# EAGLE schematic NAMUR (EAGLE 9.6.2)
Assembly variants: basic

## Sheet 1 of 3: Input connector, power
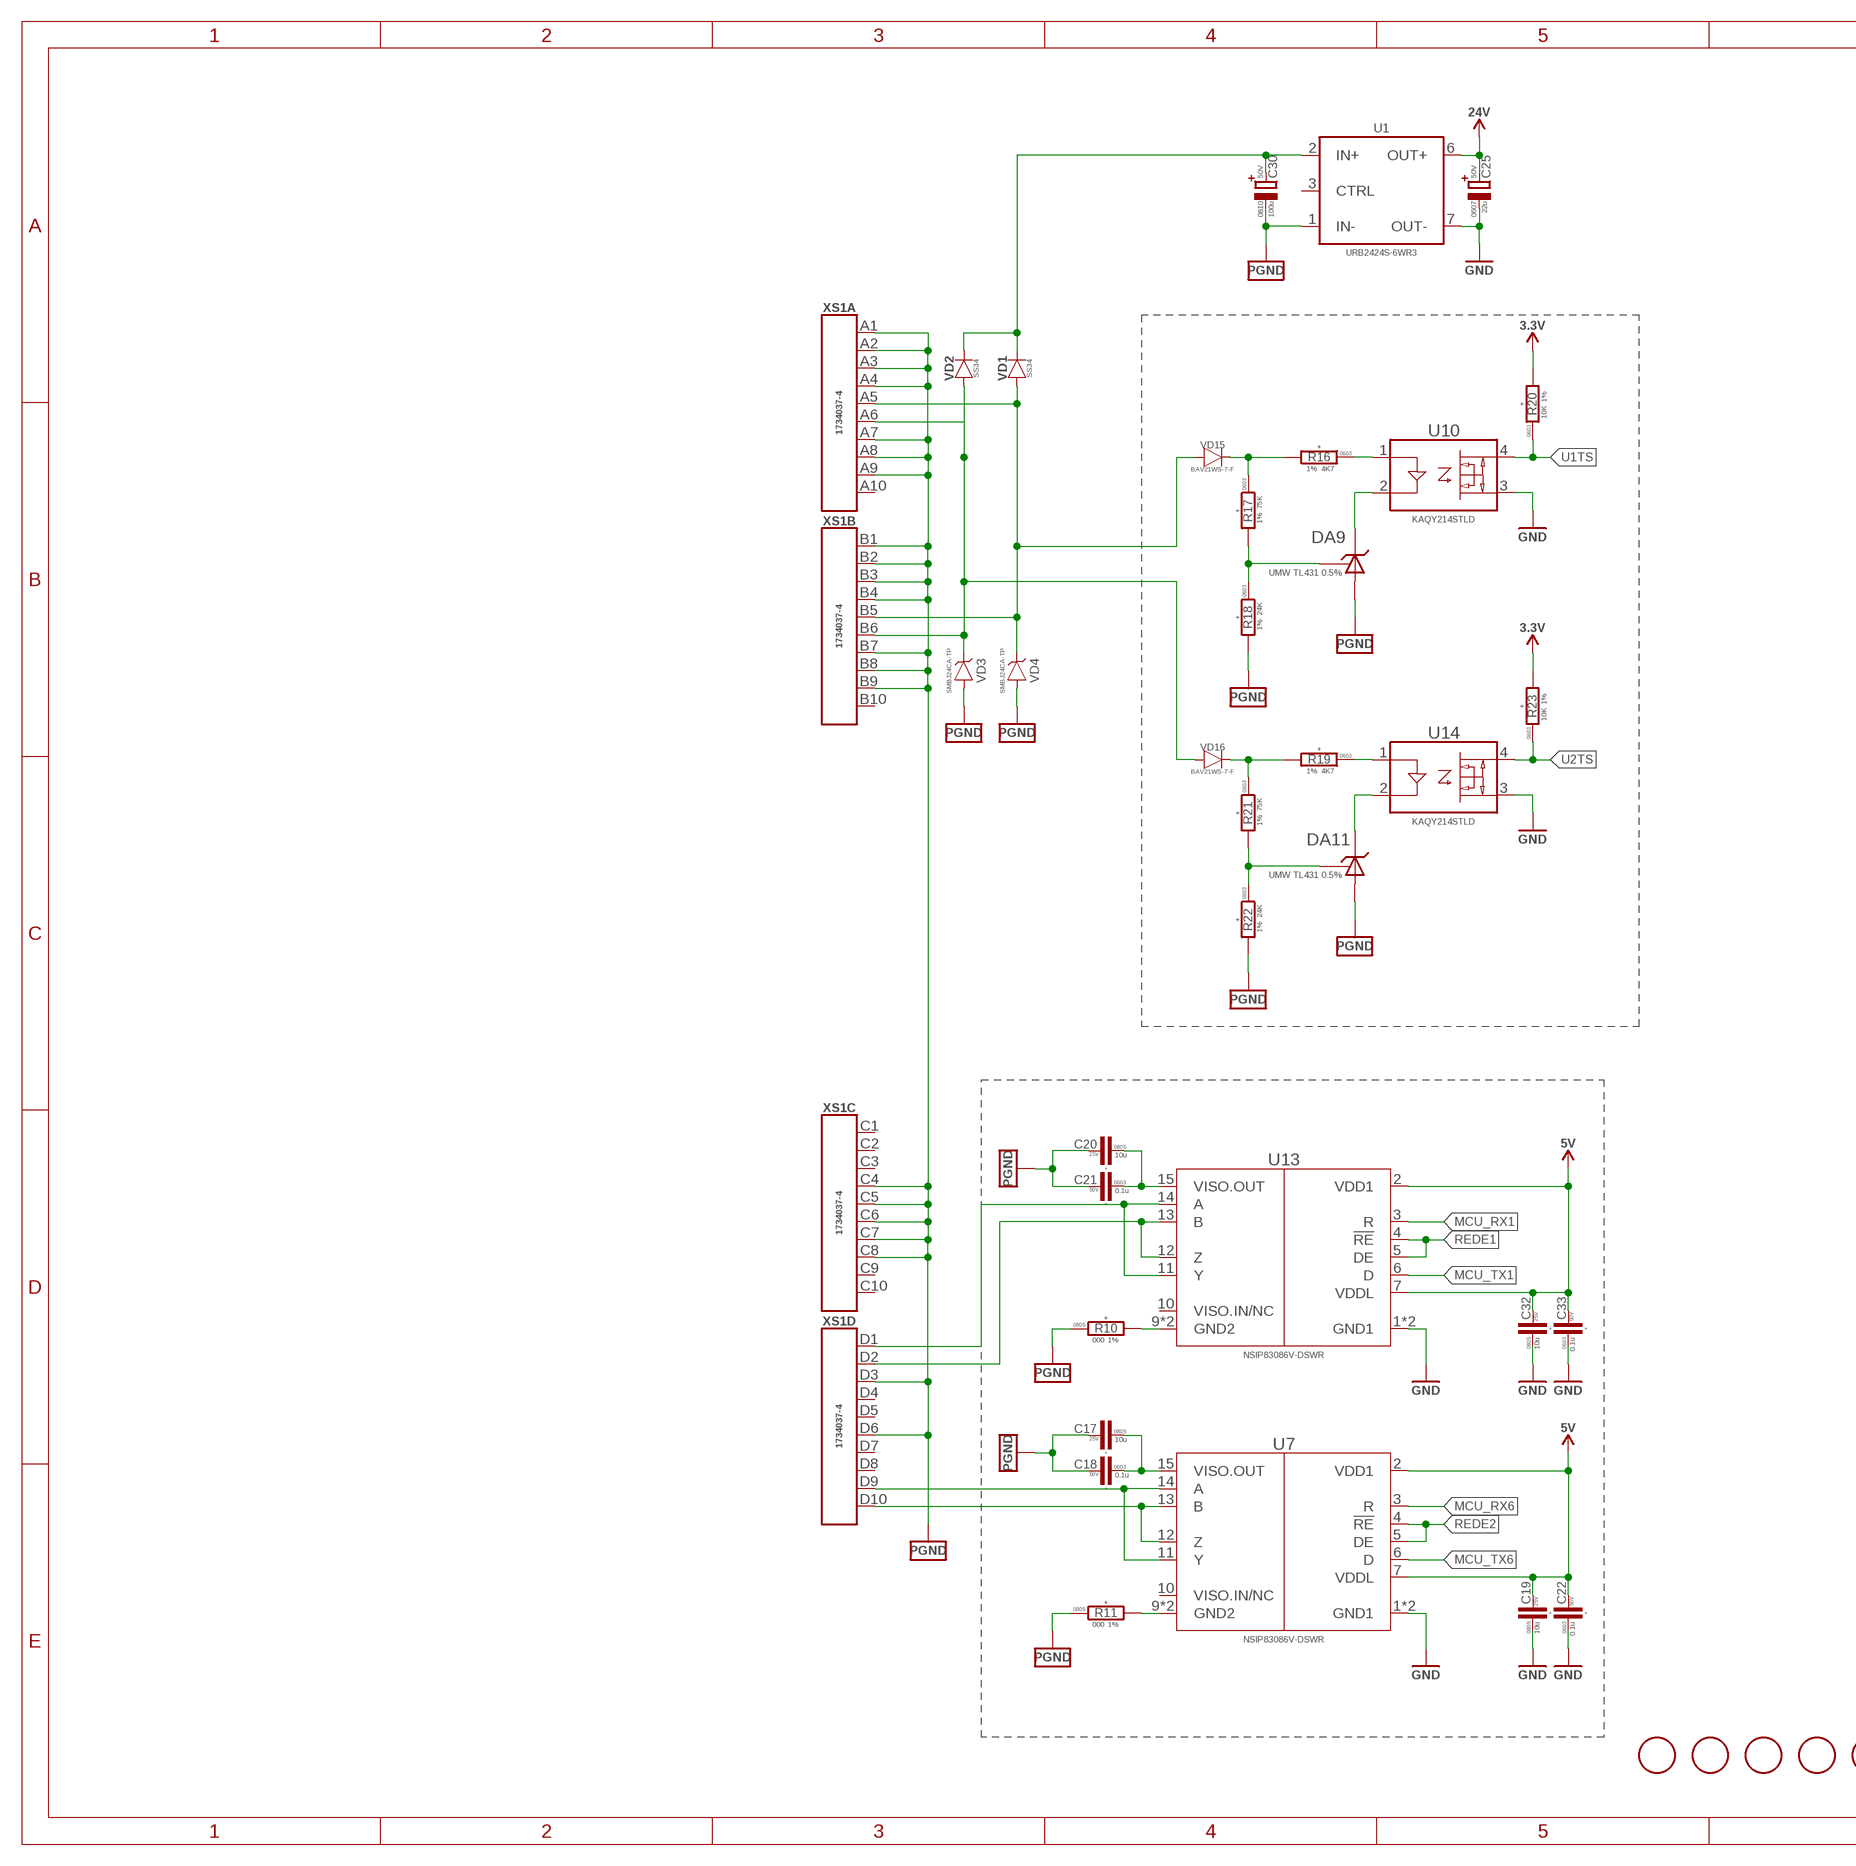
[diagram p0: schematic, sheet 1, part 1 of 2]
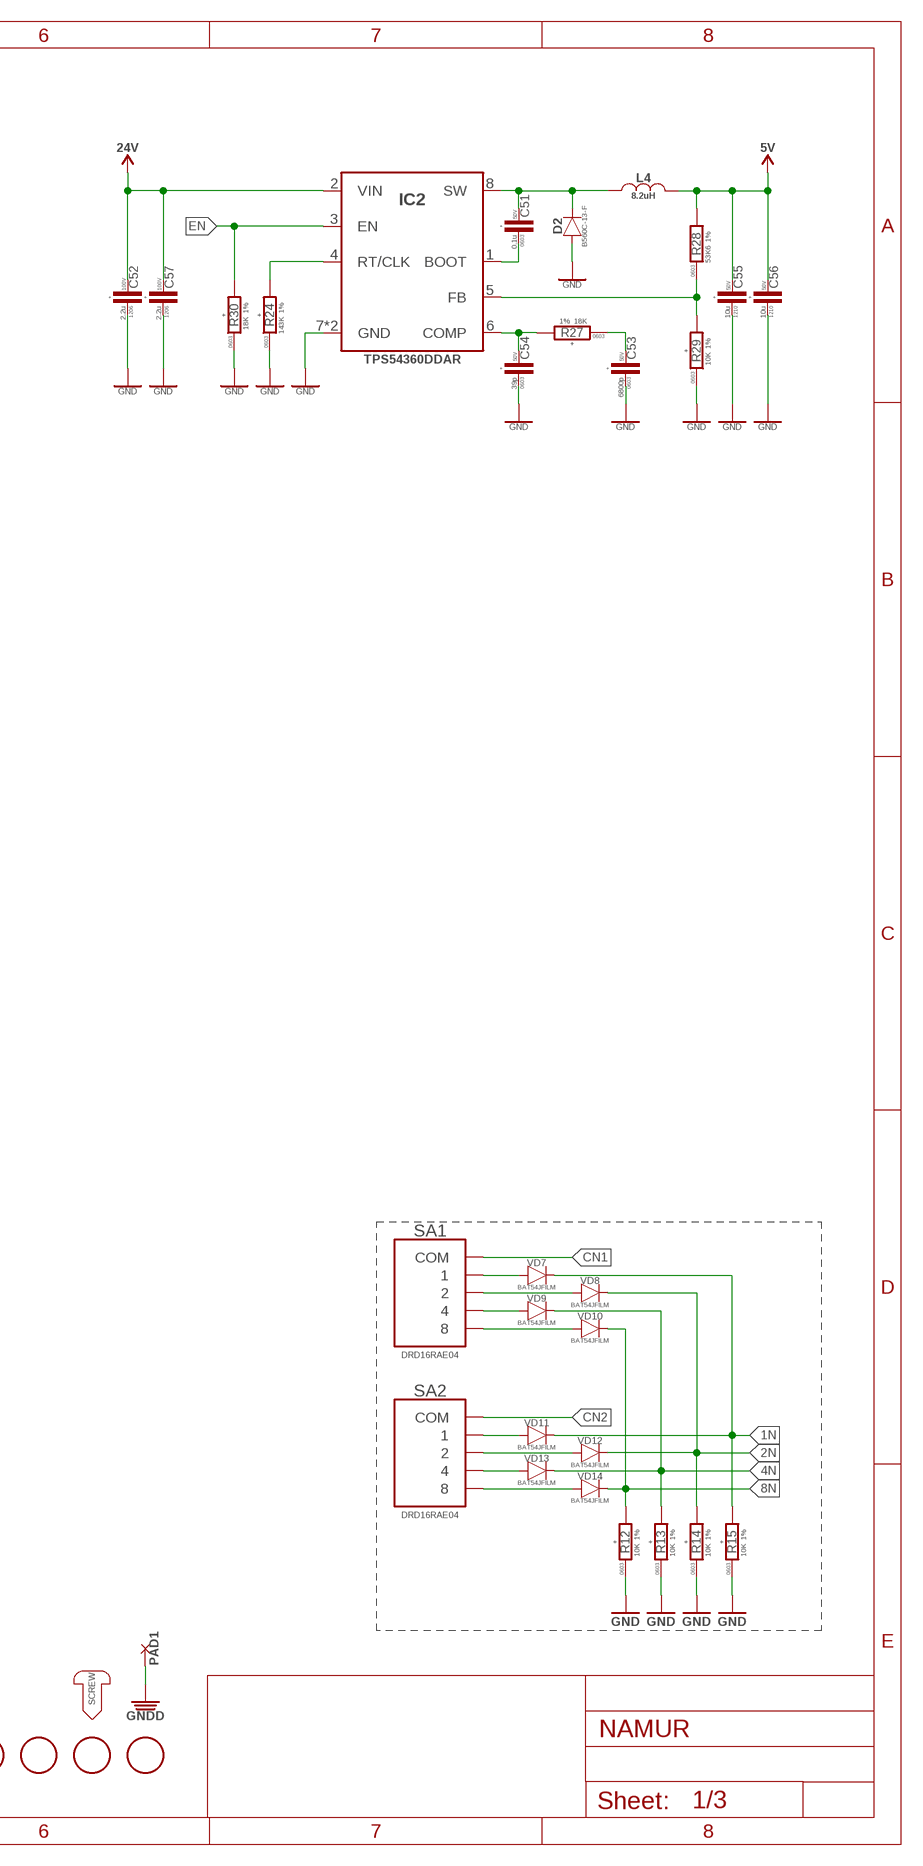
[diagram p1: schematic, sheet 1, part 2 of 2]

### Parts
C17  10u  C-0805  [C0805]
C18  0.1u  C-0603  [C0603]
C19  10u  C-0805  [C0805]
C20  10u  C-0805  [C0805]
C21  0.1u  C-0603  [C0603]
C22  0.1u  C-0603  [C0603]
C25  22u  CPOL-SMD_6.3X7.7  [CAP_SMD_6.3X7.7]
C30  100u  CPOL-SMD-8X10  [SMD-0810]
C32  10u  C-0805  [C0805]
C33  0.1u  C-0603  [C0603]
C51  0.1u  C-0603  [C0603]
C52  2.2u  C-1206  [C1206]
C53  6800p  C-0603  [C0603]
C54  39p  C-0603  [C0603]
C55  10u  C-1210  [C1210]
C56  10u  C-1210  [C1210]
C57  2.2u  C-1206  [C1206]
D2  B560C  [DO-214AB(SMC)]
DA9  TL431  [SOT23-3]
DA11  TL431  [SOT23-3]
FD1  FIDUCIALMOUNT  [FIDUCIAL_MOUNT]  (not fitted in variant basic)
FD2  FIDUCIALMOUNT  [FIDUCIAL_MOUNT]  (not fitted in variant basic)
FD3  FIDUCIALMOUNT  [FIDUCIAL_MOUNT]  (not fitted in variant basic)
FD4  FIDUCIALMOUNT  [FIDUCIAL_MOUNT]  (not fitted in variant basic)
FD5  FIDUCIALMOUNT  [FIDUCIAL_MOUNT]  (not fitted in variant basic)
FD6  FIDUCIALMOUNT  [FIDUCIAL_MOUNT]  (not fitted in variant basic)
FD7  FIDUCIALMOUNT  [FIDUCIAL_MOUNT]  (not fitted in variant basic)
IC2  TPS54360  [SOIC8-POWERPAD]
L4  8.2uH  8.2µH-CDRH105R  [CDRH105R]
PAD1  PAD-8.3X3  [8.3X3]  (not fitted in variant basic)
R10  000  R-1%-0805  [R0805]
R11  000  R-1%-0805  [R0805]
R12  10K  R-1%-0603  [R0603]
R13  10K  R-1%-0603  [R0603]
R14  10K  R-1%-0603  [R0603]
R15  10K  R-1%-0603  [R0603]
R16  4K7  R-1%-0603  [R0603]
R17  75K  R-1%-0603  [R0603]
R18  24K  R-1%-0603  [R0603]
R19  4K7  R-1%-0603  [R0603]
R20  10K  R-1%-0603  [R0603]
R21  75K  R-1%-0603  [R0603]
R22  24K  R-1%-0603  [R0603]
R23  10K  R-1%-0603  [R0603]
R24  143K  R-1%-0603  [R0603]
R27  18K  R-1%-0603  [R0603]
R28  53K6  R-1%-0603  [R0603]
R29  10K  R-1%-0603  [R0603]
R30  18K  R-1%-0603  [R0603]
SA1  DRD16RAE04  [DRD16RAE04]
SA2  DRD16RAE04  [DRD16RAE04]
SCR1  SCREW-M3-D3.1  [PCB_SCREW_M3-D3.1]  (not fitted in variant basic)
U1  URB2424S-6WR3  [URB_S-6WR3]
U7  NSIP83086(V)  [SOIC16-300MIL]
U10  KAQY214-SOP-4  [SOP-4]
U13  NSIP83086(V)  [SOIC16-300MIL]
U14  KAQY214-SOP-4  [SOP-4]
VD1  SS34  [DO-214AC(SMA)]
VD2  SS34  [DO-214AC(SMA)]
VD3  SMBJ24CA-SMB  [DO-214AA(SMB)]
VD4  SMBJ24CA-SMB  [DO-214AA(SMB)]
VD7  BAT54JFILM  [SOD323]
VD8  BAT54JFILM  [SOD323]
VD9  BAT54JFILM  [SOD323]
VD10  BAT54JFILM  [SOD323]
VD11  BAT54JFILM  [SOD323]
VD12  BAT54JFILM  [SOD323]
VD13  BAT54JFILM  [SOD323]
VD14  BAT54JFILM  [SOD323]
VD15  BAV21WS  [SOD323]
VD16  BAV21WS  [SOD323]
XS1  1734037-4  [1734037-4]

### Nets
1N: R15.2 VD7.C VD11.C ; also sheet 2
2N: R14.2 VD8.C VD12.C ; also sheet 2
4N: R13.2 VD9.C VD13.C ; also sheet 2
8N: R12.2 VD10.C VD14.C ; also sheet 2
BOOT5: C51.1 IC2.1(BOOT)
CN1: SA1.C_1(COM) SA1.C_2(COM) ; also sheet 2
CN2: SA2.C_1(COM) SA2.C_2(COM) ; also sheet 2
EN: IC2.3(EN) R30.2 ; also sheet 3
GND: C19.1 C22.1 C25.- C32.1 C33.1 C52.P$1 C53.1 C54.1 C55.1 C56.1 C57.P$1 D2.A IC2.7(GND) IC2.POWERPAD(GND) R12.1 R13.1 R14.1 R15.1 R24.1 R29.1 R30.1 U1.7(OUT-) U7.1(GND1) U7.8(GND1) U10.3(EMITTER) U13.1(GND1) U13.8(GND1) U14.3(EMITTER) ; also sheet 2,3
GNDD: PAD1.P$1 ; also sheet 3
ISO24V: C30.+ U1.2(IN+) VD1.C VD2.C
MCU_RX1: U13.3(R) ; also sheet 2
MCU_RX6: U7.3(R) ; also sheet 2
MCU_TX1: U13.6(D) ; also sheet 2
MCU_TX6: U7.6(D) ; also sheet 2
N$17: DA9.2(C) U10.2(C)
N$18: DA9.1(R) R17.2 R18.1
N$19: R16.1 U10.1(A)
N$20: R16.2 R17.1 VD15.C
N$22: DA11.2(C) U14.2(C)
N$23: DA11.1(R) R21.2 R22.1
N$24: R19.1 U14.1(A)
N$25: R19.2 R21.1 VD16.C
N$33: IC2.4(RT/CLK) R24.2
N$34: C54.2 IC2.6(COMP) R27.2
N$35: C53.2 R27.1
N$36: IC2.5(FB) R28.1 R29.2
N$43: R11.2 U7.9(GND2) U7.16(GND2)
N$46: C20.1 C21.1 U13.15(VISO.OUT)
N$48: VD1.A VD4.C VD15.A XS1.A5 XS1.B5
N$49: VD2.A VD3.C VD16.A XS1.A6 XS1.B6
N$51: U7.11(Y) U7.14(A) XS1.D9
N$53: U7.12(Z) U7.13(B) XS1.D10
N$69: R10.2 U13.9(GND2) U13.16(GND2)
N$74: U13.11(Y) U13.14(A) XS1.D1
N$75: U13.12(Z) U13.13(B) XS1.D2
N$82: C17.1 C18.1 U7.15(VISO.OUT)
N$84: SA1.1 VD7.A
N$85: SA1.2 VD8.A
N$86: SA1.4 VD9.A
N$90: SA1.8 VD10.A
N$92: SA2.1 VD11.A
N$93: SA2.2 VD12.A
N$94: SA2.4 VD13.A
N$98: SA2.8 VD14.A
PGND: C17.2 C18.2 C20.2 C21.2 C30.- DA9.3(A) DA11.3(A) R10.1 R11.1 R18.2 R22.2 U1.1(IN-) VD3.A VD4.A XS1.A1 XS1.A2 XS1.A3 XS1.A4 XS1.A7 XS1.A8 XS1.A9 XS1.B1 XS1.B2 XS1.B3 XS1.B4 XS1.B7 XS1.B8 XS1.B9 XS1.C4 XS1.C5 XS1.C6 XS1.C7 XS1.C8 XS1.D3 XS1.D6
REDE1: U13.4(!RE) U13.5(DE) ; also sheet 2
REDE2: U7.4(!RE) U7.5(DE) ; also sheet 2
SW10: C51.2 D2.C IC2.8(SW) L4.1
U1TS: R20.1 U10.4(COLLECTOR) ; also sheet 2
U2TS: R23.1 U14.4(COLLECTOR) ; also sheet 2
VDD_3V3: R20.2 R23.2 ; supply symbol labelled 3.3V ; also sheet 2
VDD_5V: C19.2 C22.2 C32.2 C33.2 C55.2 C56.2 L4.2 R28.2 U7.2(VDD1) U7.7(VDDL) U13.2(VDD1) U13.7(VDDL) ; supply symbol labelled 5V ; also sheet 2,3
VDD_24V [HV]: C25.+ C52.P$2 C57.P$2 IC2.2(VIN) U1.6(OUT+) ; supply symbol labelled 24V ; also sheet 3
Unconnected: U1.3(CTRL) U7.10(VISO.IN/NC) U13.10(VISO.IN/NC) XS1.A10 XS1.B10 XS1.C1 XS1.C2 XS1.C3 XS1.C9 XS1.C10 XS1.D4 XS1.D5 XS1.D7 XS1.D8

## Sheet 2 of 3: MCU
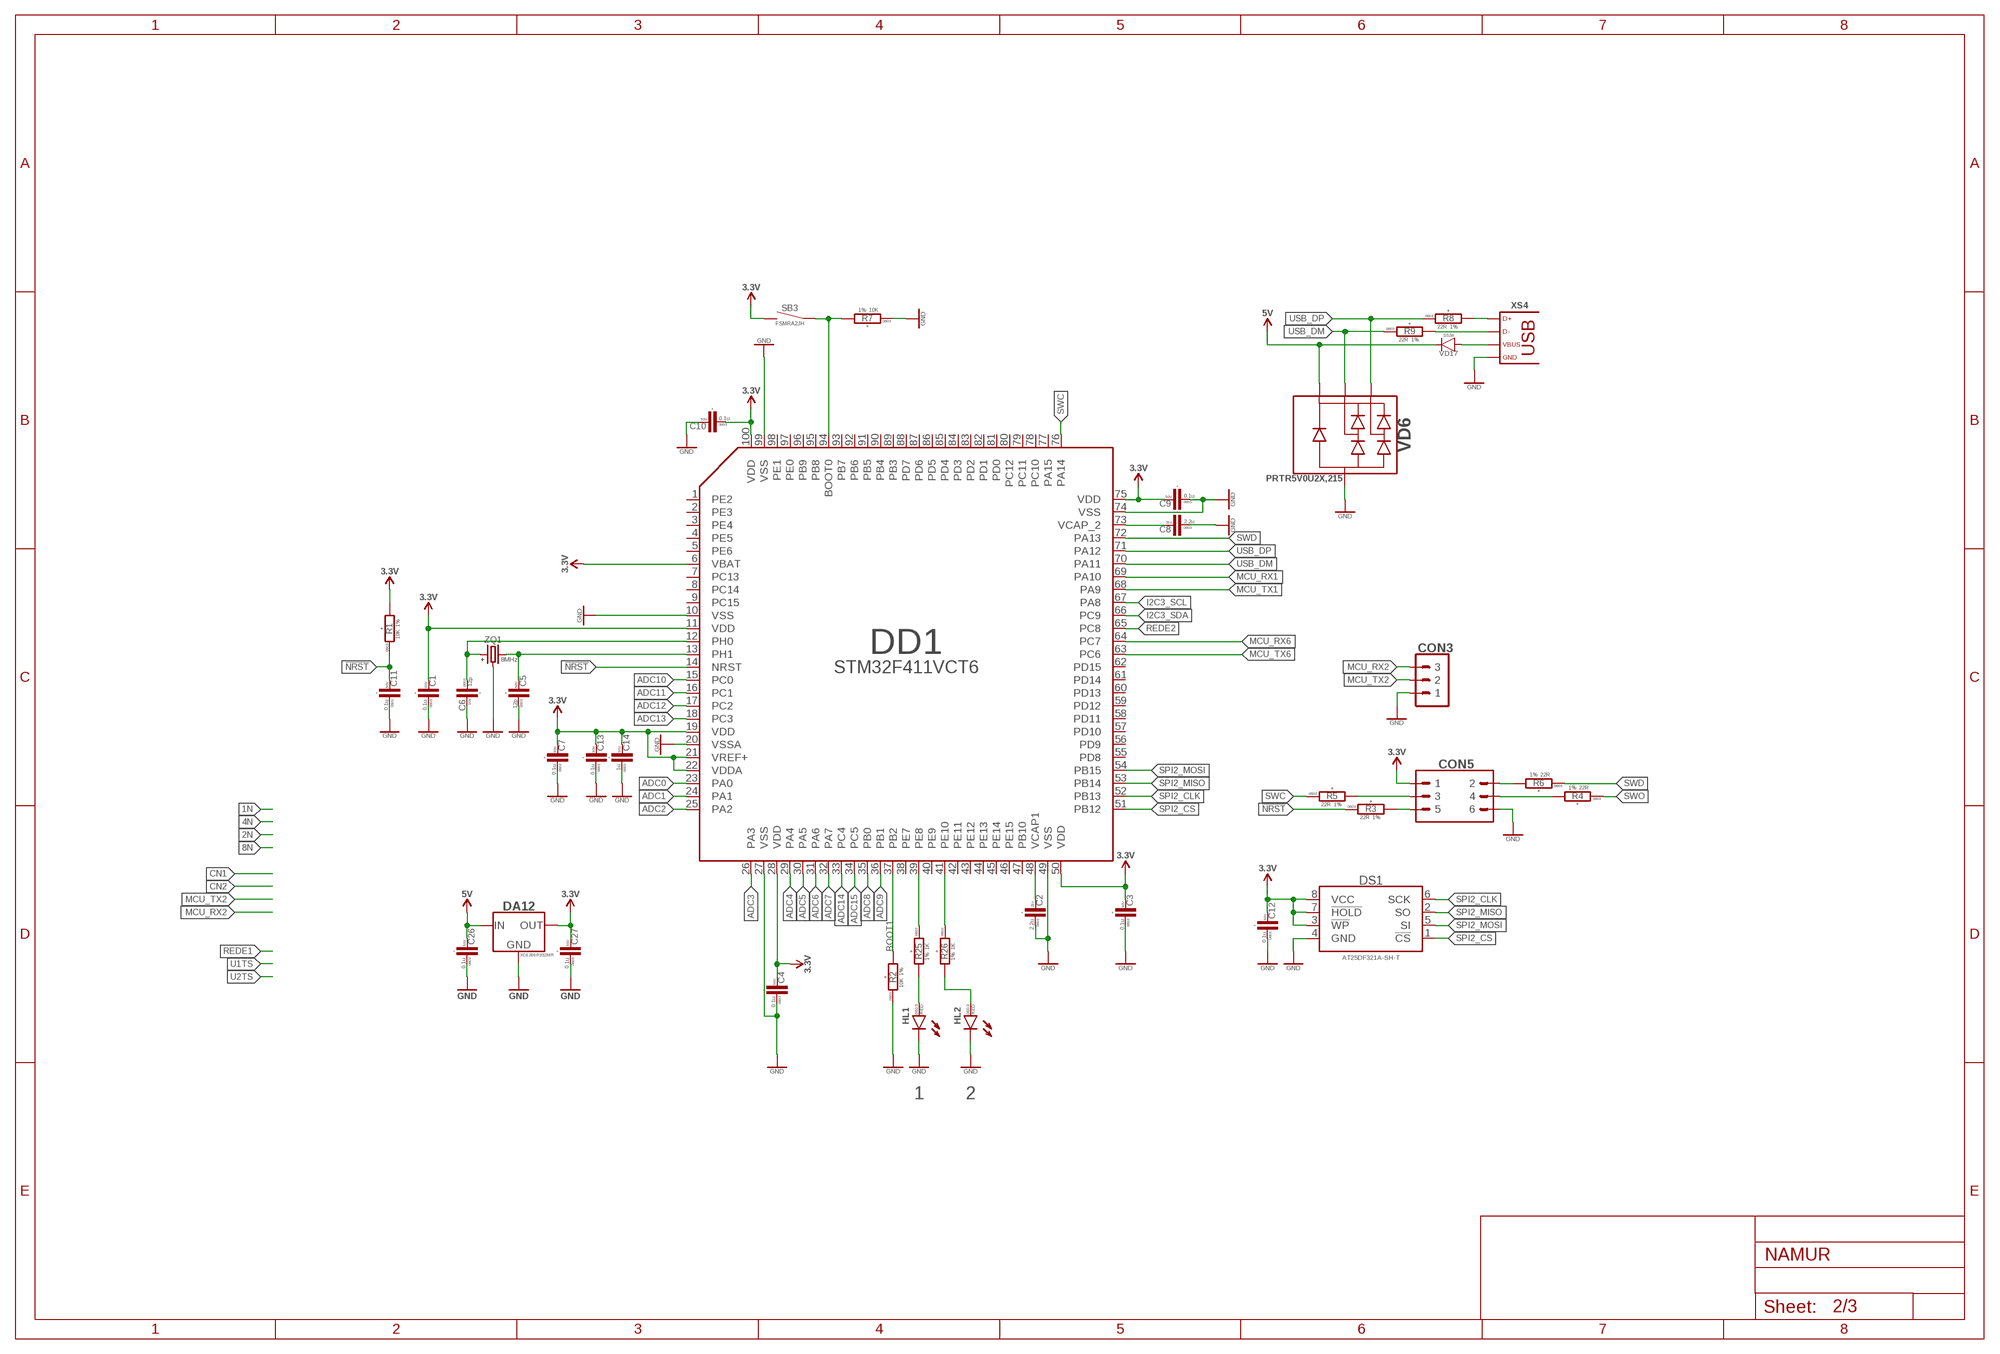
[diagram p2: schematic, sheet 2]

### Parts
C1  0.1u  C-0603  [C0603]
C2  2.2u  C-0603  [C0603]
C3  0.1u  C-0603  [C0603]
C4  0.1u  C-0603  [C0603]
C5  12p  C-0603  [C0603]
C6  12p  C-0603  [C0603]
C7  0.1u  C-0603  [C0603]
C8  2.2u  C-0603  [C0603]
C9  0.1u  C-0603  [C0603]
C10  0.1u  C-0603  [C0603]
C11  0.1u  C-0603  [C0603]
C12  0.1u  C-0603  [C0603]
C13  0.1u  C-0603  [C0603]
C14  1u  C-0603  [C0603]
C26  0.1u  C-0603  [C0603]
C27  0.1u  C-0603  [C0603]
CON3  PINHEAD_1X03-2.54  [PLS3]  (not fitted in variant basic)
CON5  PINHEAD_2X03-PTH-2.54  [PLD6]  (not fitted in variant basic)
DA12  XC6206P332  [SOT23-3]
DD1  STM32F411VCT6  [LQFP100]
DS1  AT25DF321A  [SOIC8-208MIL]
HL1  LED-0603  [LED0603]
HL2  LED-0603  [LED0603]
R1  10K  R-1%-0603  [R0603]
R2  10K  R-1%-0603  [R0603]
R3  22R  R-1%-0603  [R0603]
R4  22R  R-1%-0603  [R0603]
R5  22R  R-1%-0603  [R0603]
R6  22R  R-1%-0603  [R0603]
R7  10K  R-1%-0603  [R0603]
R8  22R  R-1%-0603  [R0603]
R9  22R  R-1%-0603  [R0603]
R25  1K  R-1%-0603  [R0603]
R26  1K  R-1%-0603  [R0603]
SB3  TACT_SWITCH-KLS-KLS7-TS6606  [KLS7-TS6606-5.0-180]
VD6  PRTR5V0U2X  [SOT143B]
VD17  SS34  [DO-214AC(SMA)]
XS4  USB-TYPE-B  [USB-B]
ZQ1  8MHz  CRYSTAL-4P-3.2X2.5  [OSCILLATOR-3.2X2.5-4P]

### Nets
!NRST: C11.2 DD1.14(NRST) R1.1 R3.1
ADC0: DD1.23(PA0) ; also sheet 3
ADC1: DD1.24(PA1) ; also sheet 3
ADC2: DD1.25(PA2) ; also sheet 3
ADC3: DD1.26(PA3) ; also sheet 3
ADC4: DD1.29(PA4) ; also sheet 3
ADC5: DD1.30(PA5) ; also sheet 3
ADC6: DD1.31(PA6) ; also sheet 3
ADC7: DD1.32(PA7) ; also sheet 3
ADC8: DD1.35(PB0) ; also sheet 3
ADC9: DD1.36(PB1) ; also sheet 3
ADC10: DD1.15(PC0) ; also sheet 3
ADC11: DD1.16(PC1) ; also sheet 3
ADC12: DD1.17(PC2) ; also sheet 3
ADC13: DD1.18(PC3) ; also sheet 3
ADC14: DD1.33(PC4) ; also sheet 3
ADC15: DD1.34(PC5) ; also sheet 3
BOOT0: DD1.94(BOOT0) R7.2 SB3.1
BOOT1: DD1.37(PB2) R2.2
GND: C1.1 C2.1 C3.1 C4.1 C5.1 C6.2 C7.1 C8.1 C9.1 C10.2 C11.1 C12.1 C13.1 C14.1 C26.1 C27.1 CON3.1 CON5.6 DA12.1(GND) DD1.10(VSS) DD1.20(VSSA) DD1.27(VSS) DD1.49(VSS) DD1.74(VSS) DD1.99(VSS) DS1.4(GND) HL1.C HL2.C R2.1 R7.1 VD6.1(C) XS4.4(GND) XS4.5_1(GND) XS4.5_2(GND) ZQ1.2(GND) ZQ1.4(GND) ; also sheet 1,3
I2C3_SCL: DD1.67(PA8) ; also sheet 3
I2C3_SDA: DD1.66(PC9) ; also sheet 3
MCU_RX1: DD1.69(PA10) ; also sheet 1
MCU_RX2: CON3.3
MCU_RX6: DD1.64(PC7) ; also sheet 1
MCU_TX1: DD1.68(PA9) ; also sheet 1
MCU_TX2: CON3.2
MCU_TX6: DD1.63(PC6) ; also sheet 1
N$1: C2.2 DD1.48(VCAP1)
N$2: C8.2 DD1.73(VCAP_2)
N$3: CON5.5 R3.2
N$4: C6.1 DD1.12(PH0) ZQ1.1
N$5: C5.2 DD1.13(PH1) ZQ1.3
N$6: CON5.4 R4.2
N$7: CON5.3 R5.2
N$8: CON5.2 R6.2
N$21: HL1.A R25.2
N$26: HL2.A R26.2
N$27: R25.1
N$37: R26.1
N$70: R9.2 XS4.2(D-)
N$71: R8.2 XS4.3(D+)
N$72: VD17.A XS4.1(VBUS)
REDE2: DD1.65(PC8) ; also sheet 1
SPI2_CLK: DD1.52(PB13) DS1.6(SCK)
SPI2_CS: DD1.51(PB12) DS1.1(!CS)
SPI2_MISO: DD1.53(PB14) DS1.2(SO)
SPI2_MOSI: DD1.54(PB15) DS1.5(SI)
SWC: DD1.76(PA14) R5.1
SWD: DD1.72(PA13) R6.1
SWO: R4.1
USB_DM: DD1.70(PA11) R9.1 VD6.3(D2)
USB_DP: DD1.71(PA12) R8.1 VD6.2(D1)
VDD_3V3: C1.2 C3.2 C4.2 C7.2 C9.2 C10.1 C12.2 C13.2 C14.2 C27.2 CON5.1 DA12.2(OUT) DD1.6(VBAT) DD1.11(VDD) DD1.21(VREF+) DD1.22(VDDA) DD1.28(VDD) DD1.50(VDD) DD1.75(VDD) DD1.100(VDD) DS1.3(!WP) DS1.7(!HOLD) DS1.8(VCC) R1.2 SB3.2 ; supply symbol labelled 3.3V ; also sheet 1
VDD_5V: C26.2 DA12.3(IN) VD6.4(A) VD17.C ; supply symbol labelled 5V ; also sheet 1,3
Unconnected: DD1.1(PE2) DD1.2(PE3) DD1.3(PE4) DD1.4(PE5) DD1.5(PE6) DD1.7(PC13) DD1.8(PC14) DD1.9(PC15) DD1.19(VDD) DD1.38(PE7) DD1.39(PE8) DD1.40(PE9) DD1.41(PE10) DD1.42(PE11) DD1.43(PE12) DD1.44(PE13) DD1.45(PE14) DD1.46(PE15) DD1.47(PB10) DD1.55(PD8) DD1.56(PD9) DD1.57(PD10) DD1.58(PD11) DD1.59(PD12) DD1.60(PD13) DD1.61(PD14) DD1.62(PD15) DD1.77(PA15) DD1.78(PC10) DD1.79(PC11) DD1.80(PC12) DD1.81(PD0) DD1.82(PD1) DD1.83(PD2) DD1.84(PD3) DD1.85(PD4) DD1.86(PD5) DD1.87(PD6) DD1.88(PD7) DD1.89(PB3) DD1.90(PB4) DD1.91(PB5) DD1.92(PB6) DD1.93(PB7) DD1.95(PB8) DD1.96(PB9) DD1.97(PE0) DD1.98(PE1)

### Notes on the sheet
- 1 | 2

## Sheet 3 of 3: Measuring part and main connector
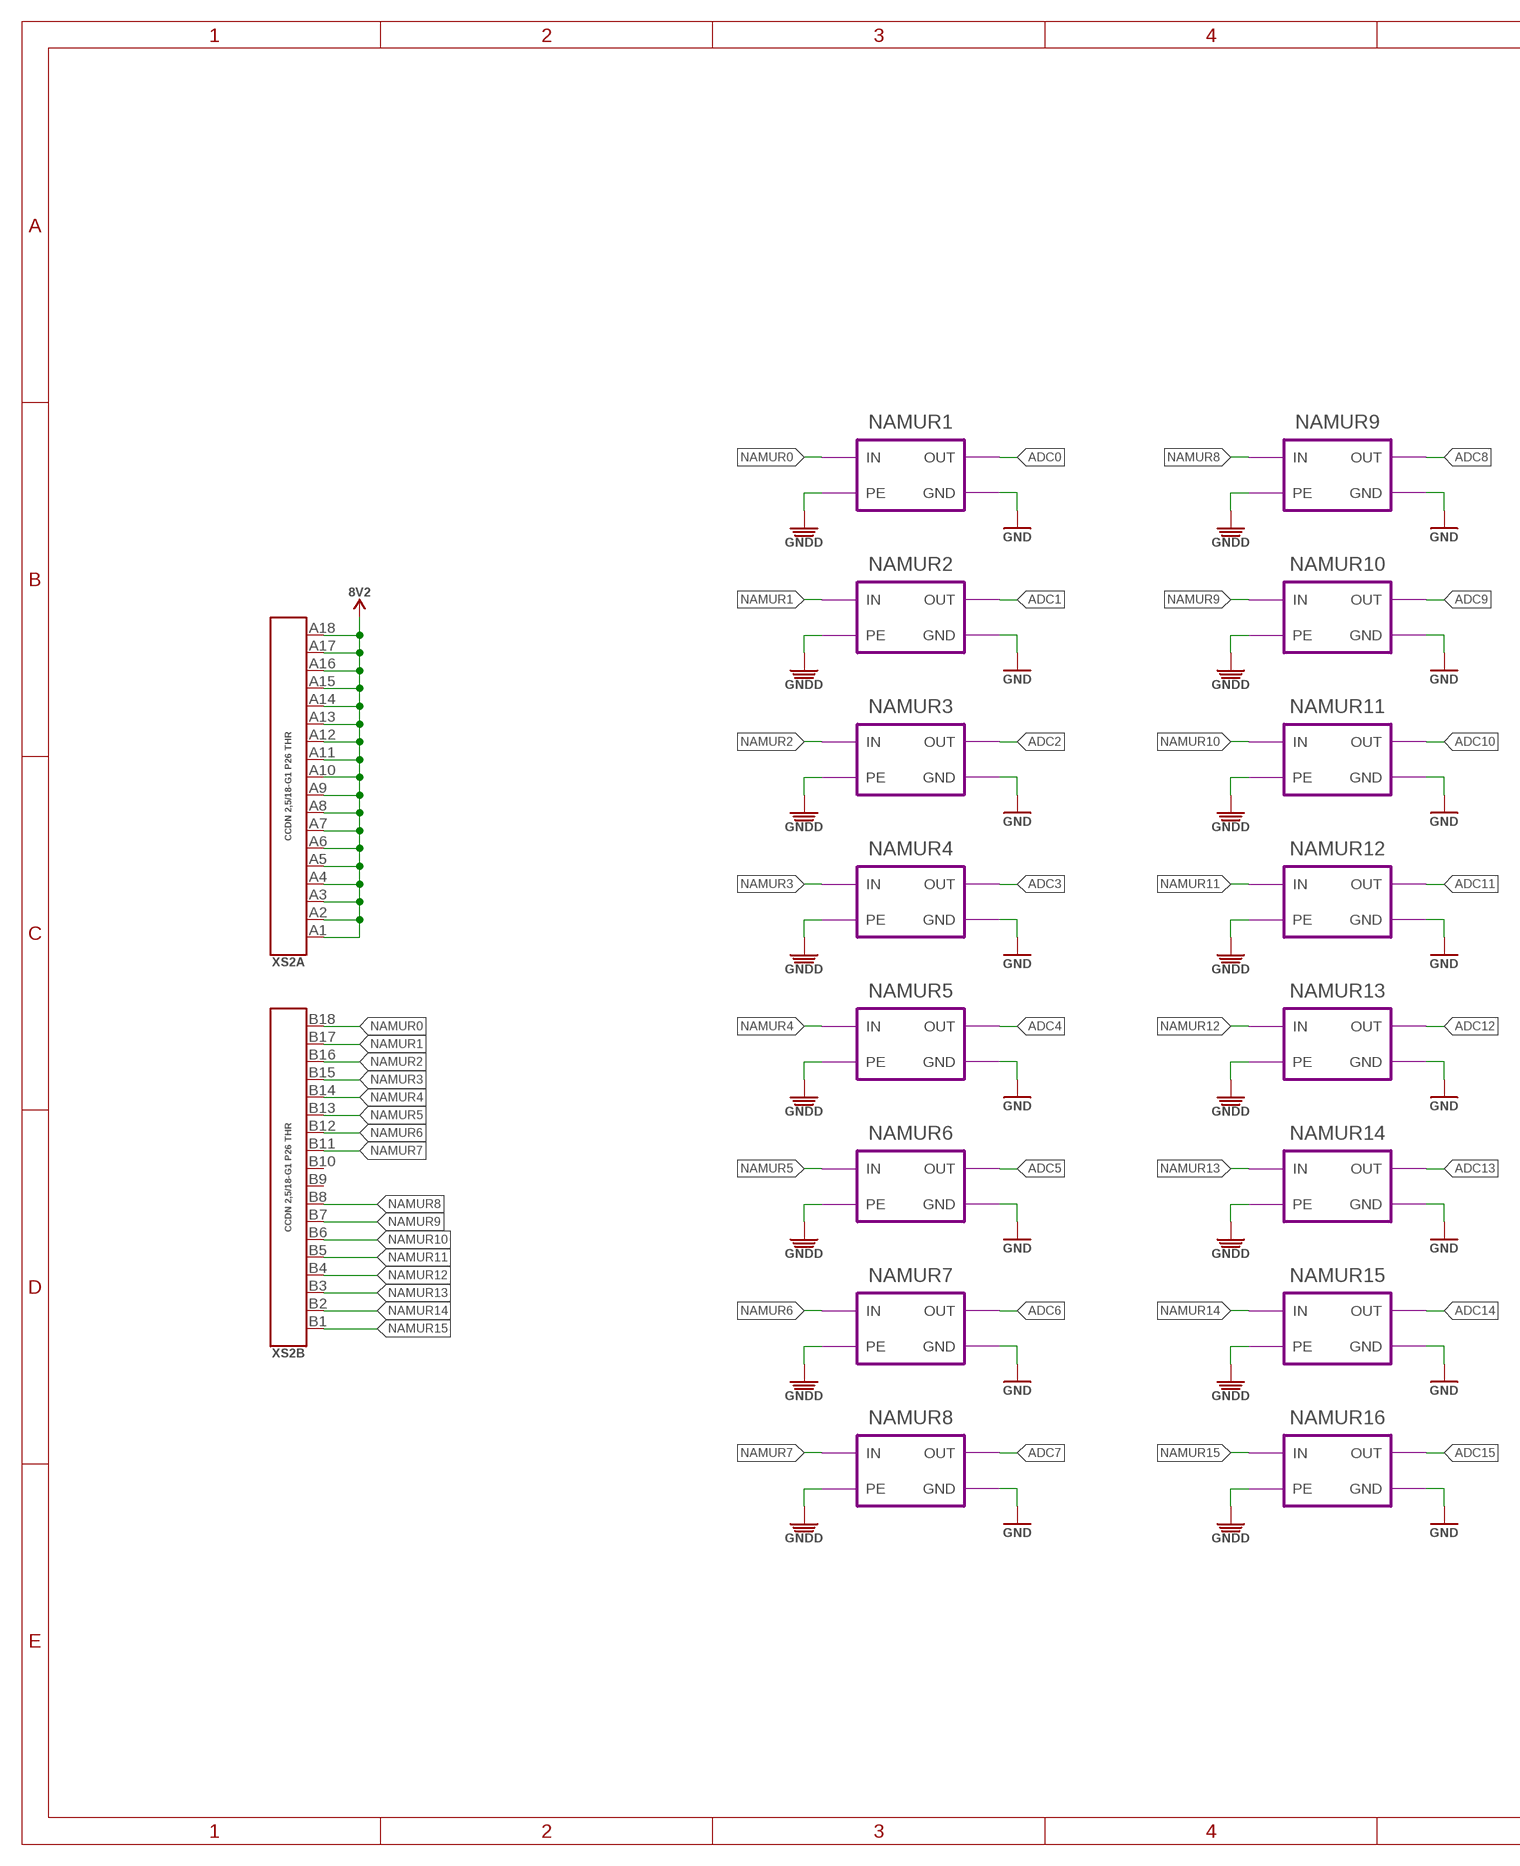
[diagram p3: schematic, sheet 3, part 1 of 2]
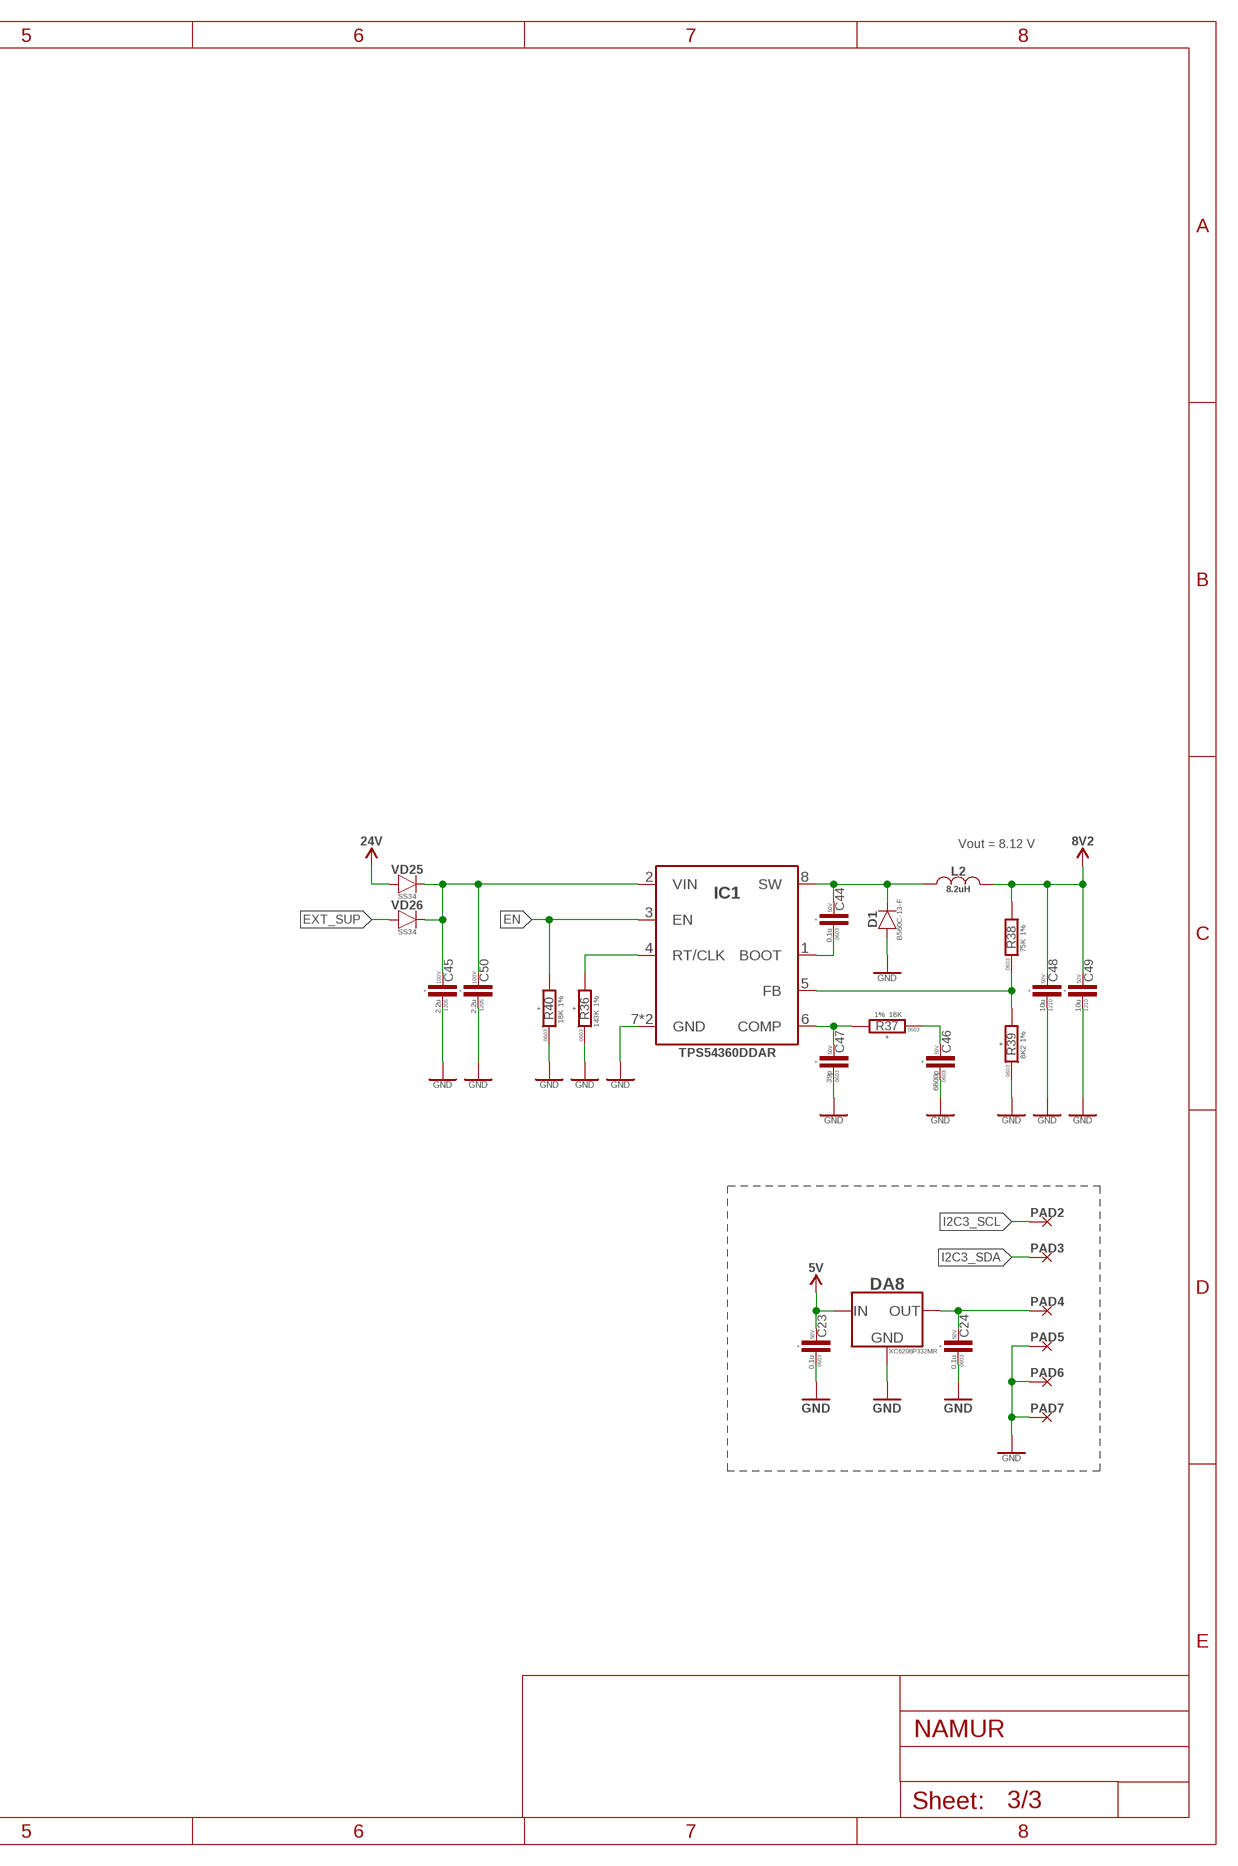
[diagram p4: schematic, sheet 3, part 2 of 2]

### Parts
C23  0.1u  C-0603  [C0603]
C24  0.1u  C-0603  [C0603]
C44  0.1u  C-0603  [C0603]
C45  2.2u  C-1206  [C1206]
C46  6800p  C-0603  [C0603]
C47  39p  C-0603  [C0603]
C48  10u  C-1210  [C1210]
C49  10u  C-1210  [C1210]
C50  2.2u  C-1206  [C1206]
D1  B560C  [DO-214AB(SMC)]
DA8  XC6206P332  [SOT23-3]
IC1  TPS54360  [SOIC8-POWERPAD]
L2  8.2uH  8.2µH-CDRH105R  [CDRH105R]
PAD2  PAD-5X3  [5X3]  (not fitted in variant basic)
PAD3  PAD-5X3  [5X3]  (not fitted in variant basic)
PAD4  PAD-5X3  [5X3]  (not fitted in variant basic)
PAD5  PAD-5X3  [5X3]  (not fitted in variant basic)
PAD6  PAD-5X3  [5X3]  (not fitted in variant basic)
PAD7  PAD-5X3  [5X3]  (not fitted in variant basic)
R36  143K  R-1%-0603  [R0603]
R37  18K  R-1%-0603  [R0603]
R38  75K  R-1%-0603  [R0603]
R39  8K2  R-1%-0603  [R0603]
R40  18K  R-1%-0603  [R0603]
VD25  SS34  [DO-214AC(SMA)]
VD26  SS34  [DO-214AC(SMA)]
XS2  CCDN2,5/18-G1P26THR  [CCDN2.5_18-G1P26THR]

### Module instances
NAMUR1 = NAMUR (part numbers offset by 100)
NAMUR2 = NAMUR (part numbers offset by 200)
NAMUR3 = NAMUR (part numbers offset by 300)
NAMUR4 = NAMUR (part numbers offset by 400)
NAMUR5 = NAMUR (part numbers offset by 500)
NAMUR6 = NAMUR (part numbers offset by 600)
NAMUR7 = NAMUR (part numbers offset by 700)
NAMUR8 = NAMUR (part numbers offset by 800)
NAMUR9 = NAMUR (part numbers offset by 900)
NAMUR10 = NAMUR (part numbers offset by 1000)
NAMUR11 = NAMUR (part numbers offset by 1100)
NAMUR12 = NAMUR (part numbers offset by 1200)
NAMUR13 = NAMUR (part numbers offset by 1300)
NAMUR14 = NAMUR (part numbers offset by 1400)
NAMUR15 = NAMUR (part numbers offset by 1500)
NAMUR16 = NAMUR (part numbers offset by 1600)

### Nets
ADC0: port NAMUR1.OUT ; also sheet 2
ADC1: port NAMUR2.OUT ; also sheet 2
ADC2: port NAMUR3.OUT ; also sheet 2
ADC3: port NAMUR4.OUT ; also sheet 2
ADC4: port NAMUR5.OUT ; also sheet 2
ADC5: port NAMUR6.OUT ; also sheet 2
ADC6: port NAMUR7.OUT ; also sheet 2
ADC7: port NAMUR8.OUT ; also sheet 2
ADC8: port NAMUR9.OUT ; also sheet 2
ADC9: port NAMUR10.OUT ; also sheet 2
ADC10: port NAMUR11.OUT ; also sheet 2
ADC11: port NAMUR12.OUT ; also sheet 2
ADC12: port NAMUR13.OUT ; also sheet 2
ADC13: port NAMUR14.OUT ; also sheet 2
ADC14: port NAMUR15.OUT ; also sheet 2
ADC15: port NAMUR16.OUT ; also sheet 2
BOOT4: C44.1 IC1.1(BOOT)
DIN [HV]: C45.P$2 C50.P$2 IC1.2(VIN) VD25.C VD26.C
EN: IC1.3(EN) R40.2 ; also sheet 1
EXT_SUP: VD26.A
GND: C23.1 C24.1 C45.P$1 C46.1 C47.1 C48.1 C49.1 C50.P$1 D1.A DA8.1(GND) IC1.7(GND) IC1.POWERPAD(GND) PAD5.P$1 PAD6.P$1 PAD7.P$1 R36.1 R39.1 R40.1 ; port NAMUR1.GND NAMUR2.GND NAMUR3.GND NAMUR4.GND NAMUR5.GND NAMUR6.GND NAMUR7.GND NAMUR8.GND NAMUR9.GND NAMUR10.GND NAMUR11.GND NAMUR12.GND NAMUR13.GND NAMUR14.GND NAMUR15.GND NAMUR16.GND ; also sheet 1,2
GNDD: port NAMUR1.PE NAMUR2.PE NAMUR3.PE NAMUR4.PE NAMUR5.PE NAMUR6.PE NAMUR7.PE NAMUR8.PE NAMUR9.PE NAMUR10.PE NAMUR11.PE NAMUR12.PE NAMUR13.PE NAMUR14.PE NAMUR15.PE NAMUR16.PE ; also sheet 1
I2C3_SCL: PAD2.P$1 ; also sheet 2
I2C3_SDA: PAD3.P$1 ; also sheet 2
N$28: IC1.4(RT/CLK) R36.2
N$30: C47.2 IC1.6(COMP) R37.2
N$31: C46.2 R37.1
N$32: IC1.5(FB) R38.1 R39.2
N$47: C24.2 DA8.2(OUT) PAD4.P$1
NAMUR0: XS2.B18 ; port NAMUR1.IN
NAMUR1: XS2.B17 ; port NAMUR2.IN
NAMUR2: XS2.B16 ; port NAMUR3.IN
NAMUR3: XS2.B15 ; port NAMUR4.IN
NAMUR4: XS2.B14 ; port NAMUR5.IN
NAMUR5: XS2.B13 ; port NAMUR6.IN
NAMUR6: XS2.B12 ; port NAMUR7.IN
NAMUR7: XS2.B11 ; port NAMUR8.IN
NAMUR8: XS2.B8 ; port NAMUR9.IN
NAMUR9: XS2.B7 ; port NAMUR10.IN
NAMUR10: XS2.B6 ; port NAMUR11.IN
NAMUR11: XS2.B5 ; port NAMUR12.IN
NAMUR12: XS2.B4 ; port NAMUR13.IN
NAMUR13: XS2.B3 ; port NAMUR14.IN
NAMUR14: XS2.B2 ; port NAMUR15.IN
NAMUR15: XS2.B1 ; port NAMUR16.IN
SW11: C44.2 D1.C IC1.8(SW) L2.1
VDD_5V: C23.2 DA8.3(IN) ; supply symbol labelled 5V ; also sheet 1,2
VDD_8V2: C48.2 C49.2 L2.2 R38.2 XS2.A1 XS2.A2 XS2.A3 XS2.A4 XS2.A5 XS2.A6 XS2.A7 XS2.A8 XS2.A9 XS2.A10 XS2.A11 XS2.A12 XS2.A13 XS2.A14 XS2.A15 XS2.A16 XS2.A17 XS2.A18 ; supply symbol labelled 8V2
VDD_24V [HV]: VD25.A ; supply symbol labelled 24V ; also sheet 1
Unconnected: XS2.B9 XS2.B10

### Notes on the sheet
- Vout = 8.12 V

## Library data of the parts
C1 C3 C4 C7 C9-C13 C18 C21-C24 C26 C27 C33 = rc:C; ALLOCATED: +; CODE: 00000063723; LCSC#: C91183; MANF: YAGEO; MANF#: CC0603JRX7R9BB104; PACKAGE: 0603; RU: Конденсатор керамический SMD 0603; VOLTAGE: 50V
C2 C8 = rc:C; ALLOCATED: +; CODE: 00000061223; LCSC#: C77047; MANF: muRata; MANF#: GRM188R61E225KA12D; PACKAGE: 0603; RU: Конденсатор керамический SMD 0603; VOLTAGE: 25V
C5 C6 = rc:C; ALLOCATED: +; CODE: 00000034347; LCSC#: C107034; MANF: YAGEO; MANF#: CC0603JRNPO9BN120; PACKAGE: 0603; RU: Конденсатор керамический SMD 0603; VOLTAGE: 50V
C14 = rc:C; ALLOCATED: +; CODE: 00000001036; LCSC#: C559769; MANF: YAGEO; MANF#: CC0603KRX7R9BB105; PACKAGE: 0603; RU: Конденсатор керамический SMD 0603; VOLTAGE: 50V
C17 C19 C20 C32 = rc:C; ALLOCATED: +; CODE: НФ-00000010; LCSC#: C89831; MANF: YAGEO; MANF#: CC0805KKX5R8BB106; PACKAGE: 0805; RU: Конденсатор керамический SMD 0805; VOLTAGE: 25V
C25 = rc:CPOL: Polar electrolytic or tantalum capacitor; CODE: НФ-00001451; LCSC#: C72505; MANF: RVT1H220M0605; MANF#: ROQANG; PACKAGE: 0607; RU: Конденсатор; VOLTAGE: 50V
C30 = rc:CPOL: Polar electrolytic or tantalum capacitor; CODE: НФ-00001452; LCSC#: C116241; MANF: Nichicon; MANF#: UUD1H101MNL1GS; PACKAGE: 0810; RU: Конденсатор; VOLTAGE: 50V
C44 C51 = rc:C; ALLOCATED: +; LCSC#: C14663; MANF: YAGEO; MANF#: CC0603KRX7R9BB104; PACKAGE: 0603; RU: Конденсатор керамический SMD 0603; VOLTAGE: 50V
C45 C50 C52 C57 = rc:C; ALLOCATED: +; PACKAGE: 1206; RU: Конденсатор керамический SMD 1206; VOLTAGE: 100V
C46 C47 C53 C54 = rc:C; ALLOCATED: +; PACKAGE: 0603; RU: Конденсатор керамический SMD 0603; VOLTAGE: 50V
C48 C49 C55 C56 = rc:C; ALLOCATED: +; LCSC#: C77102; MANF: Murata Electronics; MANF#: GRM32ER71H106K; PACKAGE: 1210; VOLTAGE: 50V
CON3 = pinhead:PINHEAD_1X03: pinheader 3P
CON5 = pinhead:PINHEAD_2X03; RU: Вилка штыревая 2.54мм 2x3 прямая
D1 D2 = Diodes:B560C: 60V 700mV@5A 5A SMC(DO-214AB) Schottky Barrier Diodes (SBD) ROHS; LCSC#: C85100; MANF: Diodes Incorporated; MANF#: B560C-13-F
DA8 DA12 = linear regulators:XC6206P: 200mA 680mV@(100mA) Fixed 3.3V~3.3V Positive 1 6V SOT-23-3L Linear Voltage Regulators (LDO) ROHS; CODE: НФ-00001456; JLC_TYPE: BASIC; LCSC#: C5446; MANF: Torex Semicon; MANF#: XC6206P332MR; RU: Микросхема
DA9 DA11 = misc:TL431: Adjustable Precision Shunt Regulator; CODE: НФ-00001457; LCSC#: C963380; MANF: Youtai Semiconductor (UMW); MANF#: UMW TL431 0.5%; RU: Прецизионный регулируемый шунтирующий стабилизатор напряжения
DD1 = stm32:STM32F411VCT6: Arm® Cortex®-M4 32b MCU+FPU, 125 DMIPS, 512KB Flash, 128KB RAM, USB OTG FS, 11 TIMs, Datasheet <https://www.lcsc.com/datasheet/C1339312.pdf?spm=wm.sxq.inf.ggs___wm.ssy.bg.0.stp&lcsc_vid=E1QMBFMDFlVWAVZSR1MIUVQAQwBcV1AFEQJaV1wDEwcxVlNRQVJaU1VSRFFbVDsOAxUeFF5JWBYZEEoKFBINSQcJGk4%3D>; CODE: 00000042535; LCSC#: C1339312; MANF: STMicroelectronics; MANF#: STM32F411VCT6; RU: Микросхема
DS1 = misc:AT25DF321A: 32-Megabit 2.7-volt Minimum SPI Serial Flash Memory Datasheet <https://static.chipdip.ru/lib/314/DOC000314047.pdf>; CODE: 00000045952; LCSC#: C6490; MANF: RENESAS; MANF#: AT25DF321A-SH-T; RU: Микросхема
FD1-FD7 = misc:FIDUCIALMOUNT; BOM: EXCLUDE
HL1 HL2 = rc:LED: Light emitting diode; CODE: НФ-00000825; COLOR: RED; LCSC#: C5158814; MANF: Ningbo Foryard Optoelectronics; MANF#: FYLS-0603URC; PACKAGE: 0603; RU: Светодиод SMD 0603
IC1 IC2 = dc-dc:TPS54360: Switching Voltage Regulators 4.5V to 60V Input, 3A, Step-Down DC-DC Converter with Eco-mode™ 8-SO PowerPAD -40 to 125 Datasheet <https://datasheet.lcsc.com/lcsc/1810261107_Texas-Instruments-TPS54360DDAR_C44377.pdf>; MANF: Texas Instruments; MANF#: TPS54360DDAR
L2 L4 = power_inductors:8.2µH; MANF: SUMIDA; MANF#: CDRH105RNP-8R2NC; RATED_CURRENT: 4,85
PAD1 = PADS:PAD
PAD2-PAD7 = PADS:PAD; BOM: EXCLUDE
R1 R2 R7 R12-R15 R20 R23 = rc:R; ALLOCATED: +; CODE: 00000010955; LCSC#: C98220; MANF: YAGEO; MANF#: RC0603FR-0710KL; PACKAGE: 0603; RU: Резистор SMD 0603; TOLERANCE: 1%
R3-R6 R8 R9 = rc:R; ALLOCATED: +; CODE: 00000038859; LCSC#: C108405; MANF: YAGEO; MANF#: RC0603JR-0722RL; PACKAGE: 0603; RU: Резистор SMD 0603; TOLERANCE: 1%
R10 R11 = rc:R; ALLOCATED: +; CODE: НФ-00001461; LCSC#: C100045; MANF: YAGEO; MANF#: RC0805FR-070RL; PACKAGE: 0805; RU: Резистор SMD 0805; TOLERANCE: 1%
R16 R19 = rc:R; ALLOCATED: +; CODE: НФ-00001479; LCSC#: C99782; MANF: YAGEO; MANF#: RC0603FR-074K7L; PACKAGE: 0603; RU: Резистор SMD 0603; TOLERANCE: 1%
R17 R21 = rc:R; ALLOCATED: +; CODE: 00000053166; LCSC#: C114636; MANF: YAGEO; MANF#: RC0603FR-0775KL; PACKAGE: 0603; RU: Резистор SMD 0603; TOLERANCE: 1%
R18 R22 = rc:R; ALLOCATED: +; CODE: 00000063334; LCSC#: C137760; MANF: YAGEO; MANF#: RC0603FR-0724KL; PACKAGE: 0603; RU: Резистор SMD 0603; TOLERANCE: 1%
R24 R27 R36 R37 = rc:R; ALLOCATED: +; PACKAGE: 0603; RU: Резистор SMD 0603; TOLERANCE: 1%
R25 R26 = rc:R; ALLOCATED: +; CODE: 00000040126; LCSC#: C22548; MANF: YAGEO; MANF#: RC0603FR-071KL; PACKAGE: 0603; RU: Резистор SMD 0603; TOLERANCE: 1%
R28 R38 = rc:R; PACKAGE: 0603; RU: Резистор SMD 0603; TOLERANCE: 1%
R29 R39 = rc:R; ALLOCATED: +; ELITAN: https://www.elitan.ru/price/item1433664; PACKAGE: 0603; RU: Резистор SMD 0603; TOLERANCE: 1%
R30 R40 = rc:R; ALLOCATED: +; LCSC#: C25810; MANF: UNI-ROYAL; MANF#: 0603WAF1802T5E; PACKAGE: 0603; RU: Резистор SMD 0603; TOLERANCE: 1%
SA1 SA2 = misc:DRD16RAE04: Dip Switch Hexadecimal 16 Position Through Hole, Right Angle Rotary for Tool Actuator 0.4VA 20VAC/DC; CODE: НФ-00001466; LCSC#: C5439367; MANF: TE Connectivity; MANF#: DRD16RAE04; RU: Переключатель DRD16RAE04 угловой на плату
SB3 = mechanical:TACT_SWITCH: tact switch; CODE: НФ-00001467; LCSC#: C7543930; MANF: TE Connectivity; MANF#: FSMRA2JH; RU: Кнопка тактовая, угловая
SCR1 = mechanical:SCREW; LENGTH: 5 mm; STANDARD: ISO7380
U1 = dc-dc:URB2424S-6WR3: 6W isolated DC-DC converter wide input and regulated single output SIP package; CODE: 00000062490; LCSC#: URB2405S-6WR3; MANF: MORNSUN; MANF#: URB2424S-6WR3; RU: Модуль питания URB2424S-6WR3 SIP8 MORNSUN
U7 U13 = serial_interfaces:NSIP83086(V): Signal Isolated RS-485 Transceiver with Integrated DC to DC Converter; CODE: 00000065919; MANF: NOVOSENSE Microelectronics; MANF#: NSIP83086V-DSWR; RU: Микросхема
U10 U14 = misc:KAQY214: Solid State SPST-NO(1 Form A) SOP-4-2.54mm; CODE: 00000062929; LCSC#: C113331; MANF: Cosmo; MANF#: KAQY214STLD; RU: Реле твердотельное
VD1 VD2 VD17 VD25 VD26 = Diodes:SS34: 40V 3A 550mV @ 3A SMA(DO-214AC) Schottky Barrier Diodes; CODE: 00000000054; LCSC#: C8678; MANF: MDD（Microdiode Electronics）; MANF#: SS34; RU: Диод Шоттки
VD3 VD4 = TVS_diodes:SMBJ24CA: TVS DIODE 24V 38.9V DO214AA; CODE: НФ-00001469; DIGIKEY#: SMBJ24CA-TPMSCT-ND; LCSC#: C908853; MANF: Micro Commercial Co; MANF#: SMBJ24CA-TP; RU: Супрессор
VD6 = TVS_diodes:PRTR5V0U2X: DIODES - ESD SOT-143; CODE: НФ-00001471; DIGIKEY#: 568-4140-2-ND; LCSC#: C12333; MANF: NXP USA Inc; MANF#: PRTR5V0U2X,215; RU: Супрессор
VD7-VD14 = Diodes:BAT54JFILM: Small signal Schottky diode; CODE: НФ-00001470; MANF: STMicroelectronics; MANF#: BAT54JFILM; RU: Диод Шоттки
VD15 VD16 = Diodes:BAV21WS: Diode Independent 200V 200mA Surface Mount SOD-323; CODE: НФ-00001472; LCSC#: C151350; MANF: DIODES BAV21WS-7-F; MANF#: BAV21WS-7-F; RU: Диод
XS1 = Connectors:1734037-4: PCB Mount Receptacle, Right Angle, Board-to-Board, 40 Position, 1.27 mm [.05 in] Centerline, Gold Flash, Through Hole - Solder, CHAMP .050 Series I; ALT: L-KLS1-SCSI-10-40FLS; CODE: НФ-00001475; MANF: TE connectivity; MANF#: 1734037-4; RU: Pазъем на плату, выводной монтаж, 40 позиций
XS2 = Connectors:CCDN2,5/18-G1P26THR: CCDN 2,5/18-G1 P26 THR - PCB header Link <https://www.phoenixcontact.com/en-pc/products/printed-circuit-board-connector-ccdn-25-18-g1-p26-thr-1734436>; ALT: WJ2EDGRHB-THR-5.0-2*18Р (36pitch); CODE: НФ-00001476; MANF: Phoenix contact; MANF#: CCDN 2,5/18-G1 P26 THR; RU: Pазъем на плату для выводного монтажа, 36 позиций
XS4 = Connectors:USB: Connector Receptacle USB 2; CODE: 00000018415; LCSC#: C189733; MANF: Connfly electronic; MANF#: USBB-1J; RU: USB розетка на плату белая, тип B угловая
ZQ1 = crystal:CRYSTAL-4P: Smd Crystal; ALLOCATED: +; CODE: НФ-00001477; LCSC#: C2682775; LOAD_CAPACITANCE: 12p; MANF: YXC Crystal Oscillators; MANF#: X32258MOB4SI; RU: Кварцевый резонатор

## Module NAMUR
Ports: GND(pwr) IN(in) OUT(out) PE(pwr)
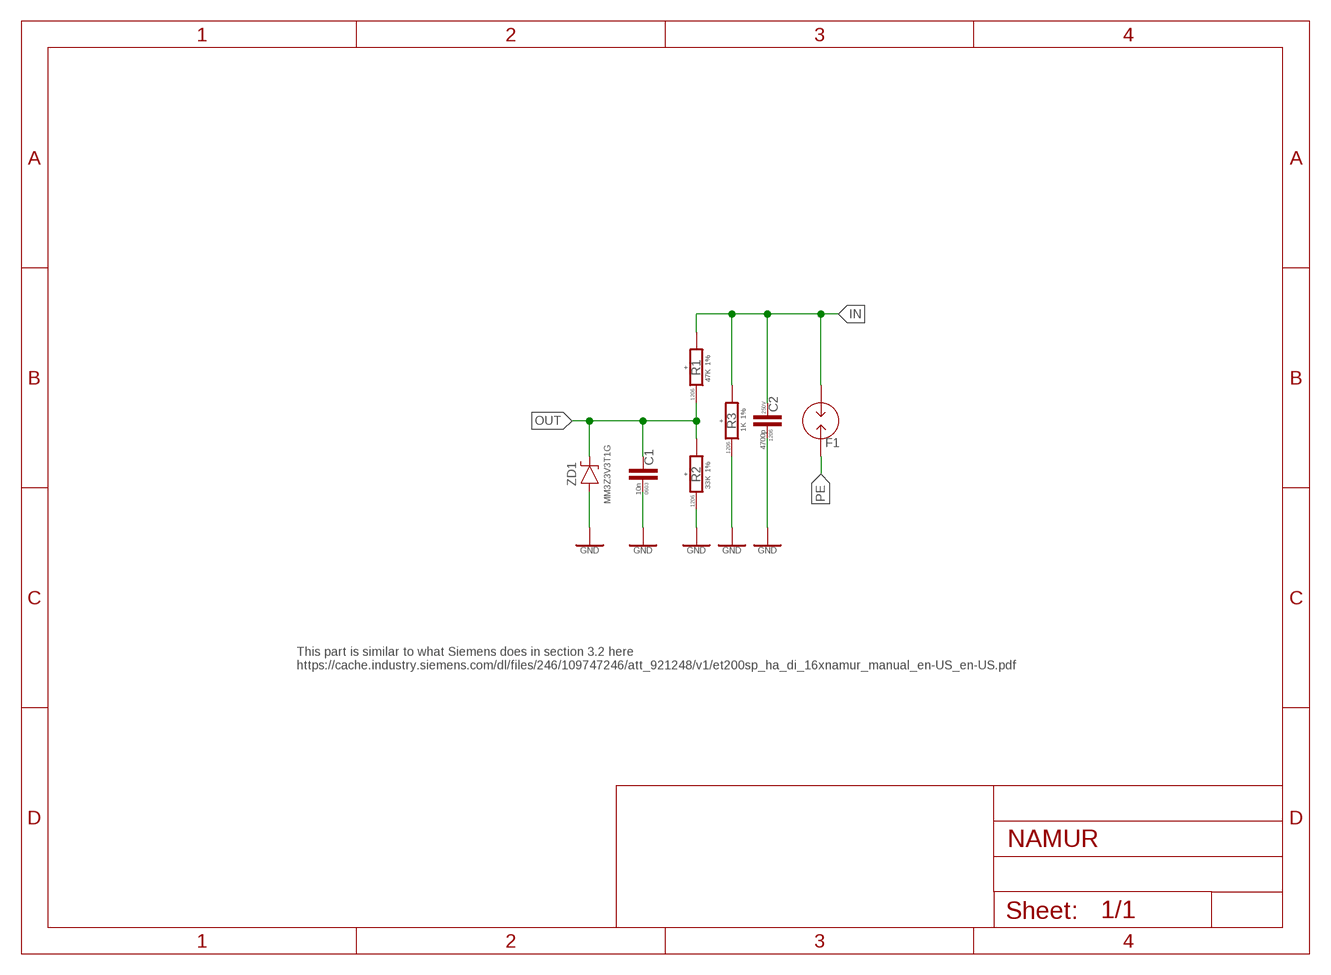
[diagram p5: schematic, module NAMUR, sheet 1]

### Parts
C1  10n  C-0603  [C0603]
C2  4700p  C-1206  [C1206]
F1  SURGE_ARRESTER-S30-A90X  [S30-A90X]
R1  47K  R-1%-1206  [R1206]
R2  33K  R-1%-1206  [R1206]
R3  1K  R-1%-1206  [R1206]
ZD1  MM3Z3V3  [SOD323]

### Nets
GND: C1.1 C2.P$1 R2.P$1 R3.P$1 ZD1.A
IN: C2.P$2 F1.1 R1.P$2 R3.P$2
OUT: C1.2 R1.P$1 R2.P$2 ZD1.C
PE: F1.2

### Notes on the sheet
- This part is similar to what Siemens does in section 3.2 here
  https://cache.industry.siemens.com/dl/files/246/109747246/att_921248/v1/et200sp_ha_di_16xnamur_manual_en-US_en-US.pdf

### Library data of the parts
C1 = rc:C; PACKAGE: 0603; RU: Конденсатор керамический SMD 0603
C2 = rc:C; PACKAGE: 1206; RU: Конденсатор керамический SMD 1206; VOLTAGE: 250V
F1 = rc:SURGE_ARRESTER: S30-A90X Surge arrester; CODE: 00000040342; LCSC#: C3660985; MANF: TDK; MANF#: B88069X9231T253; RU: Газоразрядник S30-A90X (90V, 2kA, 2 вывода, SMD1812)
R1-R3 = rc:R; ALLOCATED: +; PACKAGE: 1206; TOLERANCE: 1%
ZD1 = Diodes:MM3Z: Zener Diode 200-300mW ±6% Surface Mount SOD-323 (or SOD-323FL); LCSC#: C75073; MANF: onsemi; MANF#: MM3Z3V3T1G

## Net classes
1 HV: clearance 0.3 mm to class 0, clearance 0.3 mm